# Altium schematic sheet nusense-rs485.schdoc: NUSense
size A4; Organization: Elby Designs; Address1: 9 Follan Close; Address2: Kariong; Address3: NSW 2250; Address4: Australia; Revision: 1; SheetNumber: 6; SheetTotal: 9; DrawnBy: RS485; Engineer: Laurie Biddulph; PageSetup: Record=PageOptions|CenterHorizontal=True|CenterVertical=True|PrintScale=1.38|XCorrection=1.00|YCorrection=1.00|PrintKind=1|BorderSize=5000000|LeftOffset=0|BottomOffset=0|Orientation=2|PaperLength=1000|PaperWidth=1000|Scale=100|PaperSource=7|PrintQuality=-4|MediaType=1|DitherType=10|PaperKind=A3|PrintScaleMode=1
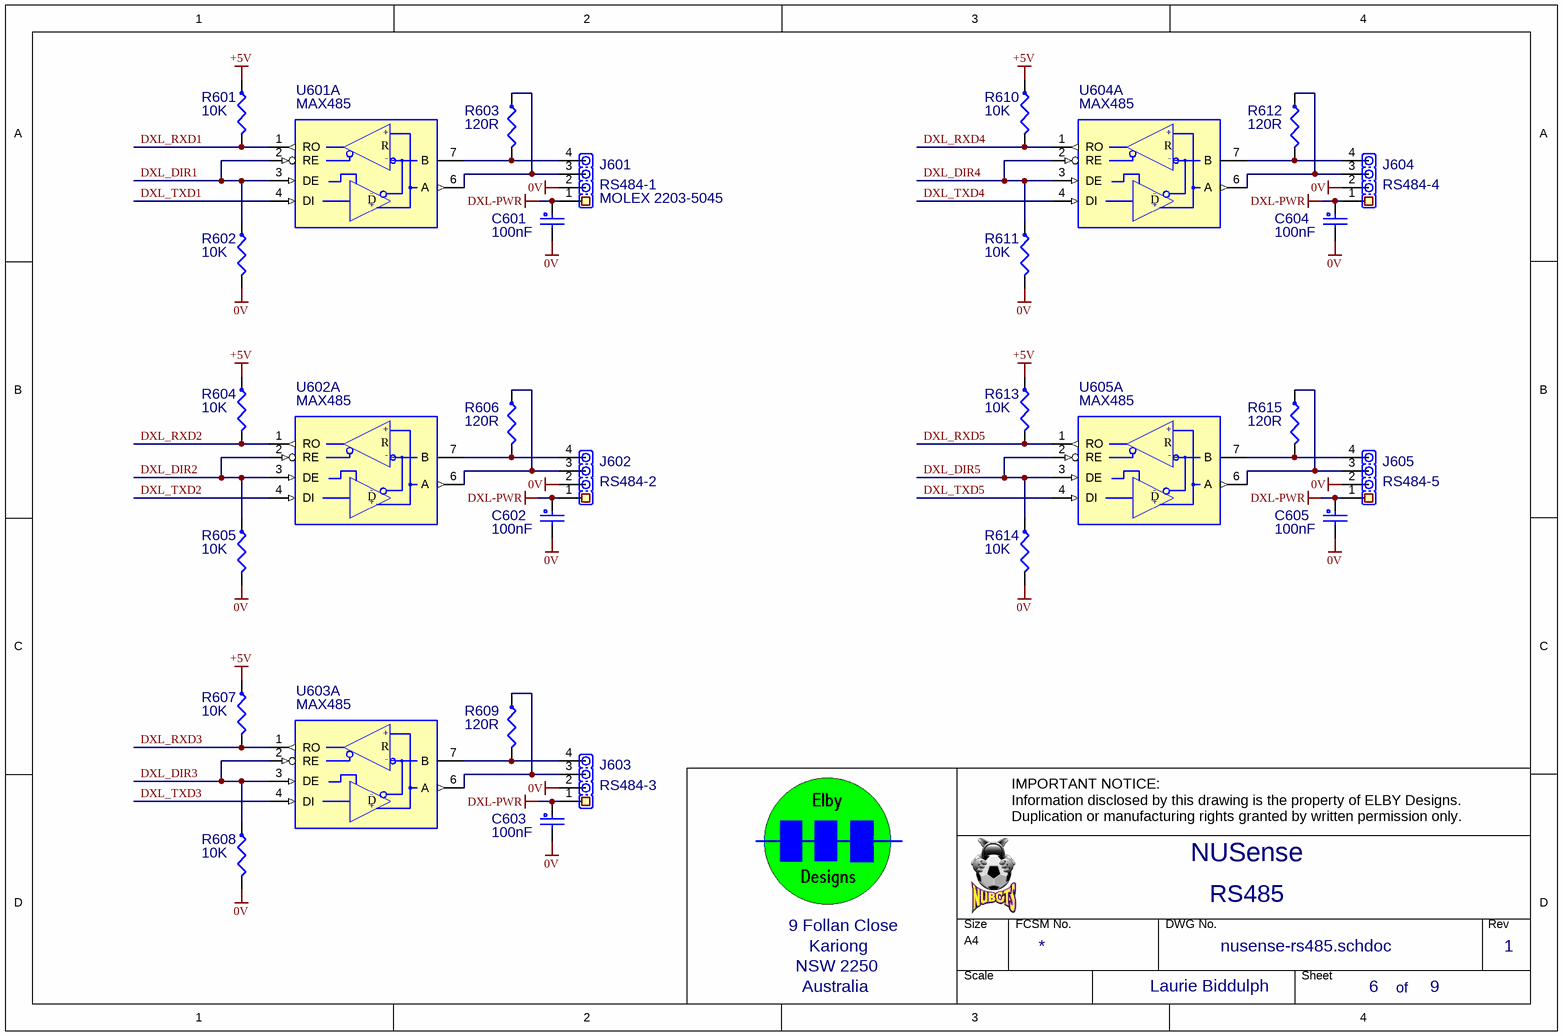
[diagram p0: nusense-rs485.schdoc]

## Parts
C601  100nF  [RAD-0.2N(LB)]
C602  100nF  [RAD-0.2N(LB)]
C603  100nF  [RAD-0.2N(LB)]
C604  100nF  [RAD-0.2N(LB)]
C605  100nF  [RAD-0.2N(LB)]
J601  RS484-1  PART: MOLEX 2203-5045  [HDR1X4(LB)]
J602  RS484-2  [HDR1X4(LB)]
J603  RS484-3  [HDR1X4(LB)]
J604  RS484-4  [HDR1X4(LB)]
J605  RS484-5  [HDR1X4(LB)]
R601  10K  [AXIAL-0.4(LB)]
R602  10K  [AXIAL-0.4(LB)]
R603  120R  [AXIAL-0.4(LB)]
R604  10K  [AXIAL-0.4(LB)]
R605  10K  [AXIAL-0.4(LB)]
R606  120R  [AXIAL-0.4(LB)]
R607  10K  [AXIAL-0.4(LB)]
R608  10K  [AXIAL-0.4(LB)]
R609  120R  [AXIAL-0.4(LB)]
R610  10K  [AXIAL-0.4(LB)]
R611  10K  [AXIAL-0.4(LB)]
R612  120R  [AXIAL-0.4(LB)]
R613  10K  [AXIAL-0.4(LB)]
R614  10K  [AXIAL-0.4(LB)]
R615  120R  [AXIAL-0.4(LB)]
U601  MAX485  [DIP-8(LB)]  (part A of 2)
U602  MAX485  [DIP-8(LB)]  (part A of 2)
U603  MAX485  [DIP-8(LB)]  (part A of 2)
U604  MAX485  [DIP-8(LB)]  (part A of 2)
U605  MAX485  [DIP-8(LB)]  (part A of 2)

## Nets
0V: C601.2 C602.2 C603.2 C604.2 C605.2 J601.2 J602.2 J603.2 J604.2 J605.2 R602.2 R605.2 R608.2 R611.2 R614.2
+5V: R601.1 R604.1 R607.1 R610.1 R613.1
DXL-PWR: C601.1 C602.1 C603.1 C604.1 C605.1 J601.1 J602.1 J603.1 J604.1 J605.1
DXL_DIR1: R602.1 U601.2(RE) U601.3(DE)
DXL_DIR2: R605.1 U602.2(RE) U602.3(DE)
DXL_DIR3: R608.1 U603.2(RE) U603.3(DE)
DXL_DIR4: R611.1 U604.2(RE) U604.3(DE)
DXL_DIR5: R614.1 U605.2(RE) U605.3(DE)
DXL_RXD1: R601.2 U601.1(RO)
DXL_RXD2: R604.2 U602.1(RO)
DXL_RXD3: R607.2 U603.1(RO)
DXL_RXD4: R610.2 U604.1(RO)
DXL_RXD5: R613.2 U605.1(RO)
DXL_TXD1: U601.4(DI)
DXL_TXD2: U602.4(DI)
DXL_TXD3: U603.4(DI)
DXL_TXD4: U604.4(DI)
DXL_TXD5: U605.4(DI)
NetJ601_3: J601.3 R603.1 U601.6(A)
NetJ601_4: J601.4 R603.2 U601.7(B)
NetJ602_3: J602.3 R606.1 U602.6(A)
NetJ602_4: J602.4 R606.2 U602.7(B)
NetJ603_3: J603.3 R609.1 U603.6(A)
NetJ603_4: J603.4 R609.2 U603.7(B)
NetJ604_3: J604.3 R612.1 U604.6(A)
NetJ604_4: J604.4 R612.2 U604.7(B)
NetJ605_3: J605.3 R615.1 U605.6(A)
NetJ605_4: J605.4 R615.2 U605.7(B)

## Notes on the sheet
- IMPORTANT NOTICE:
  Information disclosed by this drawing is the property of ELBY Designs.
  Duplication or manufacturing rights granted by written permission only.
- of
- (in symbol MAX485(LB), part A) +; R; -; D

## Library data of the parts
C601-C605 = CC-100NF(LB): Monolithic Ceramic; EMRP: CC-100NF
J601-J605 = HEADER-1X4: 1x4 Header; EMRP: JH-1X4
R601 R602 R604 R605 R607 R608 R610 R611 R613 R614 = RM-10K(LB): 0.5W 1% Metal Film Resistor; EMRP: RM-10K
R603 R606 R609 R612 R615 = RM-120R(LB): 0.5W 1% Metal Film Resistor; EMRP: RM-120R
U601-U605 = MAX485(LB): Low-power, Slew-rate limited RS485/RS422 Transceiver; EMRP: SI-1-MAX485